# Altium schematic sheet Sheet_1_2025-01-22.schdoc
size 213 x 127 mm
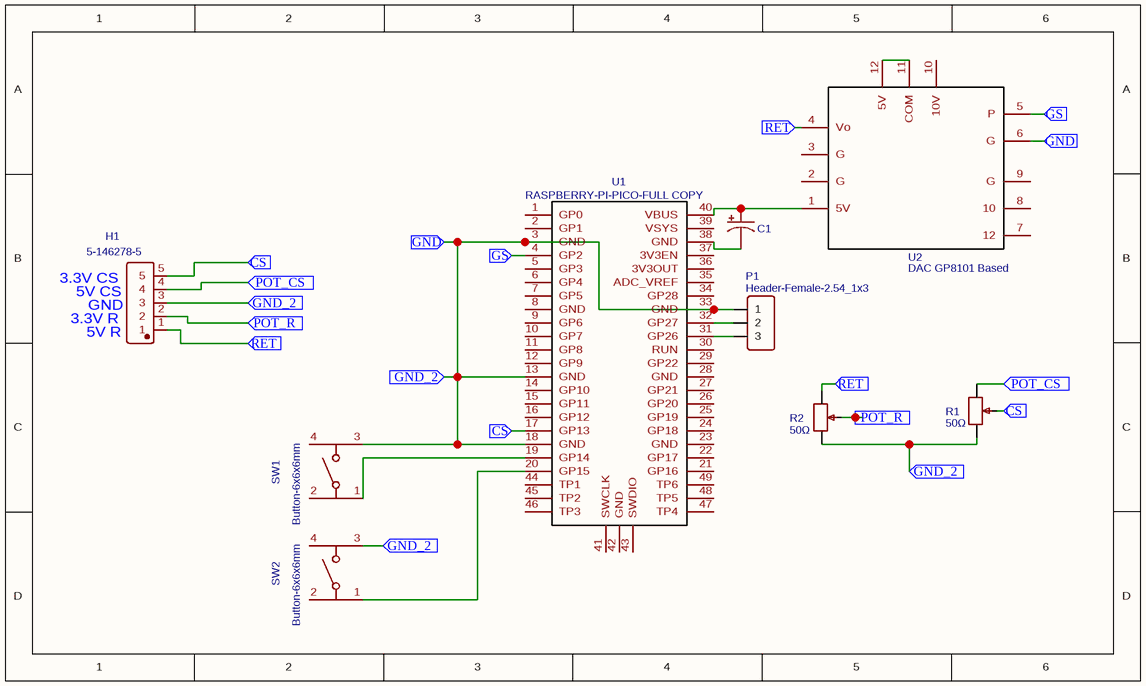
[diagram p0: Sheet_1_2025-01-22.schdoc]

## Parts
C1  SPARKFUN-CAPACITORS_CAP_POLPTH1  [SPARKFUN-CAPACITORS_CPOL-RADIAL-100UF-25V]  (value not drawn)
H1  5-146278-5  [HDR-TH_5P-P2.54-V-M_77311-101-05LF]
P1  Header-Female-2.54_1x3  [HDR-TH_3P-P2.54-V-F]
R1  50Ω  [RES-ADJ-TH_3296W]
R2  50Ω  [RES-ADJ-TH_3296W]
SW1  Button-6x6x6mm  [SW-TH_4P-L6.0-W6.0-P4.50-LS6.1]
SW2  Button-6x6x6mm  [SW-TH_4P-L6.0-W6.0-P4.50-LS6.1]
U1  RASPBERRY-PI-PICO-FULL COPY  [RASPBERRY-PI-PICO-FULL-ROMAN]
U2  DAC GP8101 Based  [DAC GP8101]

## Ports
CS (in), GND (in), GND_2 (in), GS (in), POT_CS (in), POT_R (in), RET (in)

## Nets
CS: H1.5 R1.2 U1.17(GP13) ; port CS
GND: H1.3 P1.1 R1.1 R2.1 SW1.3 SW2.3 U1.3(GND) U1.13(GND) U1.18(GND) U1.33(GND) U2.6(G) ; port GND, port GND_2
GS: U1.4(GP2) U2.5(P) ; port GS
POT_CS: H1.4 R1.3 ; port POT_CS
POT_R: H1.2 R2.2 ; port POT_R
RET: H1.1 R2.3 U2.4(Vo) ; port RET
NetC1_1: C1.1(+) U1.40(VBUS) U2.1(5V)
NetC1_2: C1.2(-) U1.38(GND)
NetP1_2: P1.2 U1.32(GP27)
NetP1_3: P1.3 U1.31(GP26)
NetSW1_1: SW1.1 U1.19(GP14)
NetSW2_1: SW2.1 U1.20(GP15)
NetU2_11: U2.11(COM) U2.12(5V)

Not connected (* = marked no-connect by the designer): SW1 2 4; SW2 2 4; U1 1(GP0) 2(GP1) 5(GP3) 6(GP4) 7(GP5) 8(GND) 9(GP6) 10(GP7) 11(GP8) 12(GP9) 14(GP10) 15(GP11) 16(GP12) 21(GP16) 22(GP17) 23(GND) 24(GP18) 25(GP19) 26(GP20) 27(GP21) 28(GND) 29(GP22) 30(RUN) 34(GP28) 35(ADC_VREF) 36(3V3OUT) 37(3V3EN) 39(VSYS) 41(SWCLK) 42(GND) 43(SWDIO) 44(TP1) 45(TP2) 46(TP3) 47(TP4) 48(TP5) 49(TP6); U2 2(G) 3(G) 7(12) 8(10) 9(G) 10(10V)

## Notes on the sheet
- (near H1) 3.3V CS
- (near H1) 5V CS
- (near H1) 3.3V R
- (near H1) 5V R
- (near H1) GND

## Library data of the parts
C1 = SPARKFUN-CAPACITORS_CAP_POLPTH1: description: Capacitor Polarized; timeStamp: 1458823985; spicePre: C; spiceSymbolName: SPARKFUN-CAPACITORS_CAP_POLPTH1
H1 = 5-146278-5: Manufacturer: TE Connectivity(泰科电子); Contributor: lcsc; Supplier: LCSC; Supplier Part: C6092052; Manufacturer Part: 5-146278-5; JLCPCB Part Class: Extended Part; spicePre: H; spiceSymbolName: 5-146278-5
P1 = Header-Female-2.54_1x3: Manufacturer: BOOMELE(博穆精密); Manufacturer Part: 2.54-1*3P母; Supplier Part: C146243; Supplier: LCSC; JLCPCB Part Class: Extended Part; spicePre: P; spiceSymbolName: Header-Female-2.54_1x3
R1 R2 = 50Ω: Manufacturer: ReliaPro; Manufacturer Part: Precision potentiometer 3296W/50ohm; nameAlias: Value; Supplier Part: C21881; Supplier: LCSC; JLCPCB Part Class: Extended Part; spicePre: R; spiceSymbolName: Precision potentiometer 3296W/50ohm
SW1 SW2 = Button-6x6x6mm: Manufacturer: BBJ; Manufacturer Part: Switch,6*6*6Plastic head,260G, 0.25mm,Straight line; Supplier Part: C71836; Supplier: LCSC; spicePre: S; spiceSymbolName: Button-6x6x6mm
U1 = RASPBERRY-PI-PICO-FULL COPY: Manufacturer: Raspberry Pi Foundation; Manufacturer Part: Raspberry Pi Pico; Contributor: yakimovroman1982; Supplier: Element14; spicePre: U; spiceSymbolName: RASPBERRY-PI-PICO-FULL COPY
U2 = DAC GP8101 Based: Contributor: 19031250; Supplier: jelectronica; spicePre: U; spiceSymbolName: DAC GP8101 Based